# EAGLE schematic BlockDiagram (EAGLE 7.5.0)
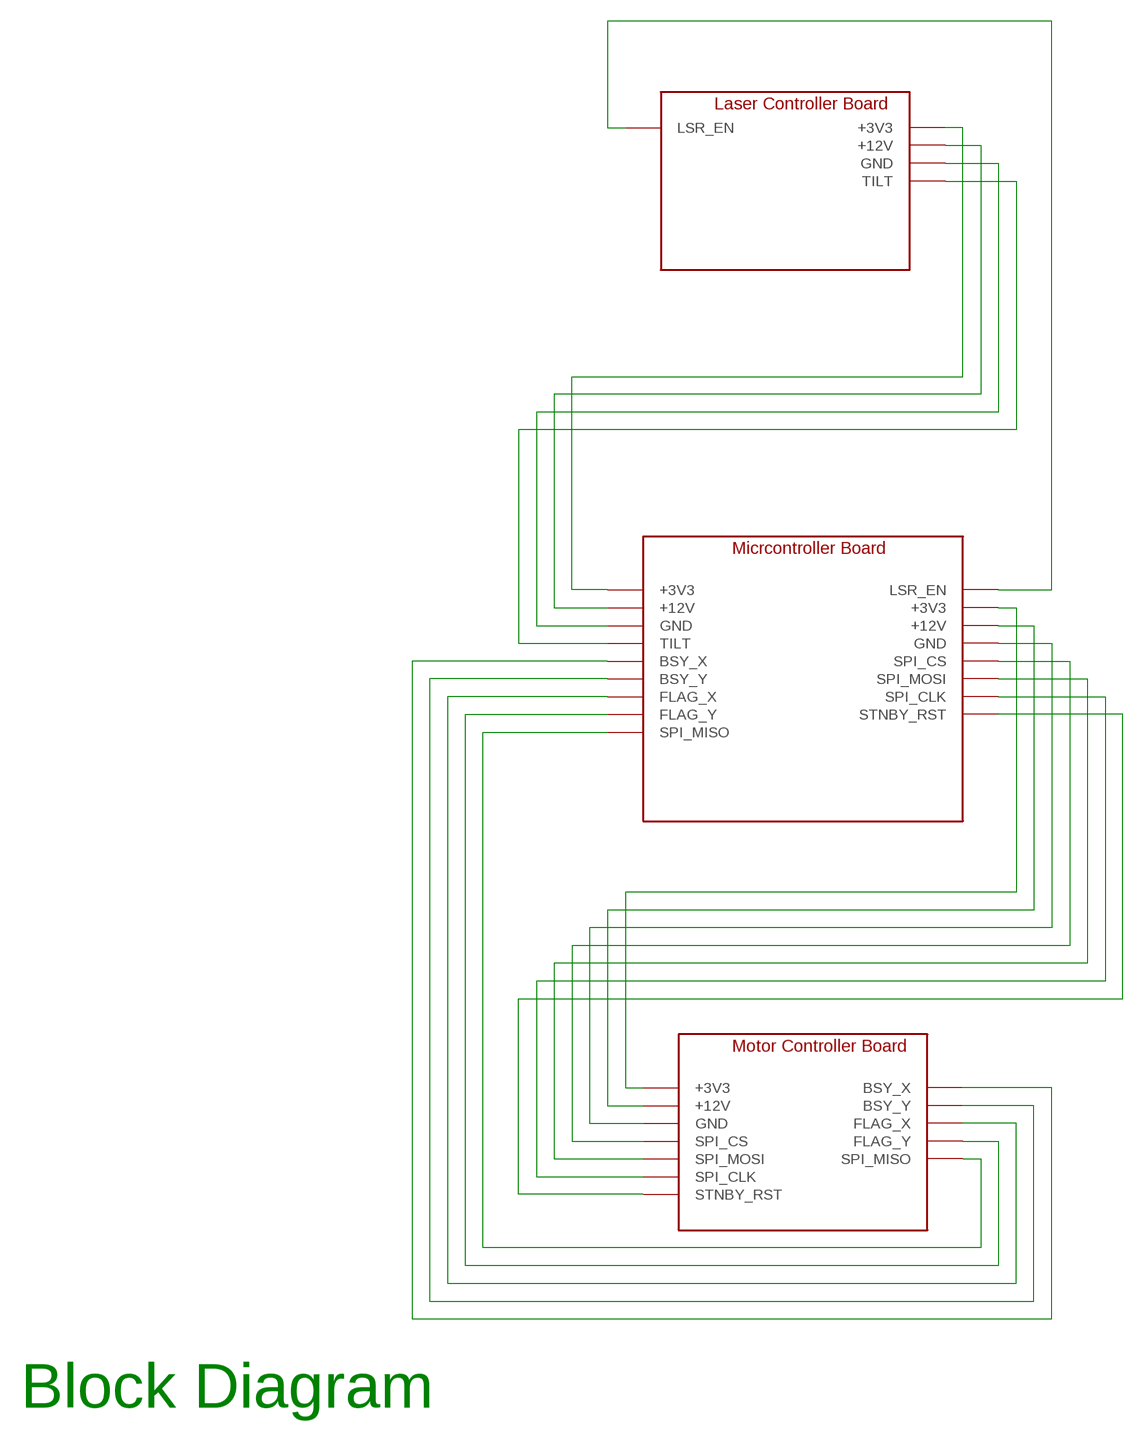
[diagram p0: schematic, sheet 1]

## Parts
U$1  MICROCONTROLLER_BOARD  [MICROCONTROLLER_BOARD]
U$2  LASER_CONTROLLER_BOARD  [LASER_CONTROLLER_BOARD]
U$3  MOTOR_CONTROLLER_BOARD  [MOTOR_CONTROLLER_BOARD]

## Nets
N$1: U$1.P$1(+3V3) U$2.P$1(+3V3)
N$2: U$1.P$3(+12V) U$2.P$2(+12V)
N$3: U$1.P$9(GND) U$2.P$3(GND)
N$4: U$1.P$17(TILT) U$2.P$5(TILT)
N$5: U$1.P$11(LSR_EN) U$2.P$4(LSR_EN)
N$6: U$1.P$2(+3V3) U$3.P$1(+3V3)
N$7: U$1.P$4(+12V) U$3.P$2(+12V)
N$8: U$1.P$10(GND) U$3.P$7(GND)
N$9: U$1.P$13(SPI_CS) U$3.P$9(SPI_CS)
N$10: U$1.P$15(SPI_MOSI) U$3.P$11(SPI_MOSI)
N$11: U$1.P$12(SPI_CLK) U$3.P$8(SPI_CLK)
N$12: U$1.P$16(STNBY_RST) U$3.P$12(STNBY_RST)
N$13: U$1.P$14(SPI_MISO) U$3.P$10(SPI_MISO)
N$14: U$1.P$8(FLAG_Y) U$3.P$6(FLAG_Y)
N$15: U$1.P$7(FLAG_X) U$3.P$5(FLAG_X)
N$16: U$1.P$6(BSY_Y) U$3.P$4(BSY_Y)
N$17: U$1.P$5(BSY_X) U$3.P$3(BSY_X)

## Notes on the sheet
- Block Diagram

## Library data of the parts
U$1 = BlockDiagramBlocks:MICROCONTROLLER_BOARD
U$2 = BlockDiagramBlocks:LASER_CONTROLLER_BOARD
U$3 = BlockDiagramBlocks:MOTOR_CONTROLLER_BOARD